# Altium schematic sheet 4-20mA.SchDoc: Isolated 4-20mA
size A4; Revision: 1; SheetNumber: 5; SheetTotal: 7; SheetSize: A4
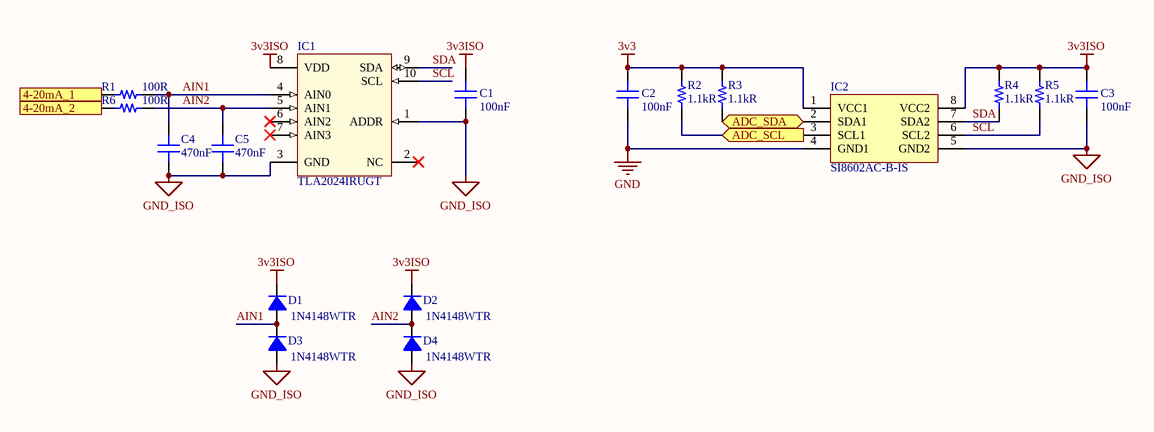
[diagram p0: 4-20mA.SchDoc]

## Parts
C1  100nF  [CAP 0603/1608]
C2  100nF  [CAP 0603/1608]
C3  100nF  [CAP 0603/1608]
C4  470nF  [CAP 0603/1608]
C5  470nF  [CAP 0603/1608]
D1  1N4148WTR  [sod123]
D2  1N4148WTR  [sod123]
D3  1N4148WTR  [sod123]
D4  1N4148WTR  [sod123]
IC1  TLA2024IRUGT  [TI X2QFN-10 2x1.5mm]
IC2  SI8602AC-B-IS  [MICROCHIP SOIC-8 208MIL WIDE]
R1  100R  [RES 0603/1608]
R2  1.1kR  [RES 0603/1608]
R3  1.1kR  [RES 0603/1608]
R4  1.1kR  [RES 0603/1608]
R5  1.1kR  [RES 0603/1608]
R6  100R  [RES 0603/1608]

## Ports
4-20mA_1 (in), 4-20mA_2 (in), ADC_SCL (in), ADC_SDA (bidir)

## Nets
3v3: C2.2 IC2.1(VCC1) R2.1 R3.1
3v3ISO: C1.2 C3.2 D1.2 D2.2 IC1.8(VDD) IC2.8(VCC2) R4.1 R5.1
GND: C2.1 IC2.4(GND1)
GND_ISO: C1.1 C3.1 C4.1 C5.1 D3.1 D4.1 IC1.1(ADDR) IC1.3(GND) IC2.5(GND2)
4-20mA_1: R1.1 ; port 4-20mA_1
4-20mA_2: R6.1 ; port 4-20mA_2
ADC_SCL: IC2.3(SCL1) R2.2 ; port ADC_SCL
ADC_SDA: IC2.2(SDA1) R3.2 ; port ADC_SDA
AIN1: C4.2 D1.1 D3.2 IC1.4(AIN0) R1.2
AIN2: C5.2 D2.1 D4.2 IC1.5(AIN1) R6.2
SCL: IC1.10(SCL) IC2.6(SCL2) R5.2
SDA: IC1.9(SDA) IC2.7(SDA2) R4.2

Not connected (* = marked no-connect by the designer): IC1 2(NC)* 6(AIN2)* 7(AIN3)*

## Notes on the sheet
- Title:
- Size:
- Project:
- Revision:
- Sheet
- of
- Date:
- YıLDıZ IoT
- Elperek Mahallesi
- Saray Sokak, No:12
- SAKARYA / TURKEY
- File:

## Library data of the parts
C1-C3 = Capacitor - Ceramic: Ceramic, SMT Capacitor; Manufacturer: Samsung; Manufacturer Part Number: CL10B104JB8NNNC; Tolerance: 5%; Voltage Rating: 50V; Dielectric: X7R; Supplier 1: Digi-Key; Supplier Part Number 1: 1276-1033-1-ND; Stock 1: 223594; Pricing 1: 1 = 0,10000, 10 = 0,05300, 100 = 0,02350, 500 = 0,01680, 1000 = 0,01320 (USD); RoHS: Yes; Mount: Surface Mount; Case/Package: 0603; Case Code (Metric): 1608; Case Code (Imperial): 0603; Material: Ceramic; Contact Plating: Tin; Min Operating Temperature: -55°C; Max Operating Temperature: 125°C; Packaging: Tape and Reel; Package Quantity: 1; Capacitance: 100nF; Voltage: 50V; Length: 1.6mm; Height: 0.8mm; Width: 0.031inch; Thickness: 0.035inch; Depth: 0.8mm; Radiation Hardening: No; ComponentLink1URL: https://media.digikey.com/pdf/Data%20Sheets/Samsung%20PDFs/CL_Series_MLCC_ds.pdf?src-supplier=Digi-Key; ComponentLink1Description: https://media.digikey.com/pdf/Data%20Sheets/Samsung%20PDFs/CL_Series_MLCC_ds.pdf?src-supplier=Digi-Key; ComponentLink2URL: https://www.verical.com/server-webapp/html/getDatasheet?partID=359321&src-supplier=Verical; ComponentLink2Description: https://www.verical.com/server-webapp/html/getDatasheet?partID=359321&src-supplier=Verical; ComponentLink3URL: http://www1.futureelectronics.com/doc/SAMSUNG/CL10B104JB8NNNC.pdf?src-supplier=Future+Electronics; ComponentLink3Description: http://www1.futureelectronics.com/doc/SAMSUNG/CL10B104JB8NNNC.pdf?src-supplier=Future+Electronics; ComponentLink4URL: https://produktinfo.conrad.com/datenblaetter/450000-474999/456613-da-01-en-VS_KONDENSATOR_0603.pdf?src-supplier=Conrad; ComponentLink4Description: https://produktinfo.conrad.com/datenblaetter/450000-474999/456613-da-01-en-VS_KONDENSATOR_0603.pdf?src-supplier=Conrad
C4 C5 = Capacitor - Ceramic: Ceramic, SMT Capacitor; Manufacturer: Taiyo Yuden; Manufacturer Part Number: UMK107ABJ474KA-T; Tolerance: 10%; Voltage Rating: 50V; Dielectric: X5R; Supplier 1: Digi-Key; Supplier Part Number 1: 587-3171-1-ND; Stock 1: 299107; Pricing 1: 1 = 0,19000, 10 = 0,13700, 100 = 0,06440, 500 = 0,04516, 1000 = 0,03739 (USD); RoHS: Yes; Mount: Surface Mount; Case/Package: 0603; Case Code (Imperial): 0603; Case Code (Metric): 1608; Min Operating Temperature: -55°C; Max Operating Temperature: 85°C; Packaging: Tape and Reel; Package Quantity: 1; Capacitance: 470nF; Voltage Rating (DC): 50V; Termination: SMD/SMT; Voltage: 50V; Length: 1.6mm; Height: 0.8mm; Width: 0.8mm; Thickness: 0.037inch; Depth: 0.8mm; Radiation Hardening: No; Lead Free: Lead Free; ComponentLink1URL: https://datasheet.ciiva.com/30226/445umk107abj474ka-t-30226784.pdf?src-supplier=Onlinecomponents.com; ComponentLink1Description: https://datasheet.ciiva.com/30226/445umk107abj474ka-t-30226784.pdf?src-supplier=Onlinecomponents.com; ComponentLink2URL: https://datasheet.ciiva.com/6282/umk107abj474ka-t-6282326.pdf?src-supplier=Digi-Key; ComponentLink2Description: https://datasheet.ciiva.com/6282/umk107abj474ka-t-6282326.pdf?src-supplier=Digi-Key; ComponentLink3URL: https://datasheet.ciiva.com/15922/30umk107abj474ka-t-15922603.pdf?src-supplier=Onlinecomponents.com; ComponentLink3Description: https://datasheet.ciiva.com/15922/30umk107abj474ka-t-15922603.pdf?src-supplier=Onlinecomponents.com; ComponentLink4URL: https://datasheet.ciiva.com/11600/umk107abj474ka-t-ss-11600413.pdf?src-supplier=Avnet; ComponentLink4Description: https://datasheet.ciiva.com/11600/umk107abj474ka-t-ss-11600413.pdf?src-supplier=Avnet; ComponentLink5URL: https://datasheet.ciiva.com/6282/umk107abj474ka-t-6282332.pdf?src-supplier=Digi-Key; ComponentLink5Description: https://datasheet.ciiva.com/6282/umk107abj474ka-t-6282332.pdf?src-supplier=Digi-Key
D1-D4 = Diode: Manufacturer: SMC; Max Reverse Voltage (DC): 75V; Average Rectified Current: 250mA; Reverse Recovery Time: 4ns; ComponentLink1URL: http://www.smc-diodes.com/propdf/1N4148W%20N0571%20REV.D.pdf?src-supplier=Digi-Key; ComponentLink1Description: http://www.smc-diodes.com/propdf/1N4148W%20N0571%20REV.D.pdf?src-supplier=Digi-Key; Supplier 1: Digi-Key; Supplier Part Number 1: 1655-1360-1-ND; Manufacturer Part Number: 1N4148WTR; Stock 1: 8882; Pricing 1: 1 = 0,12000, 10 = 0,11300, 25 = 0,10720, 100 = 0,04710, 250 = 0,04524, 500 = 0,03702, 1000 = 0,02571 (USD); RoHS: No; Mount: Surface Mount; Packaging: Tape and Reel
IC1 = TI TLA202x: Integrated Circuit; Manufacturer: Texas Instruments; Number of Bits: 12; Sampling Rate: 3300S/s; Number of A/D Converters: 1; Interface: I2C; Number of Inputs: 4; Supplier 1: Digi-Key; Supplier Part Number 1: 296-48346-1-ND; Manufacturer Part Number: TLA2024IRUGT; Stock 1: 5713; Pricing 1: 1 = 1,94000, 10 = 1,74400, 25 = 1,64520, 100 = 1,31600 (USD); RoHS: No; Min Operating Temperature: -40°C; Max Operating Temperature: 85°C; Packaging: Cut Tape; ComponentLink1URL: http://www.ti.com/lit/ds/symlink/tla2022.pdf?src-supplier=Farnell; ComponentLink1Description: http://www.ti.com/lit/ds/symlink/tla2022.pdf?src-supplier=Farnell; ComponentLink2URL: http://www.ti.com/lit/ds/symlink/tla2021.pdf?src-supplier=Digi-Key; ComponentLink2Description: http://www.ti.com/lit/ds/symlink/tla2021.pdf?src-supplier=Digi-Key; ComponentLink3URL: http://www.ti.com/general/docs/suppproductinfo.tsp?distId=10&amp;gotoUrl=http%3A%2F%2Fwww.ti.com%2Flit%2Fgpn%2Ftla2021&src-supplier=Digi-Key; ComponentLink3Description: http://www.ti.com/general/docs/suppproductinfo.tsp?distId=10&amp;gotoUrl=http%3A%2F%2Fwww.ti.com%2Flit%2Fgpn%2Ftla2021&src-supplier=Digi-Key
IC2 = SI LABS SI8602: Manufacturer: Silicon Labs; Min Supply Voltage: 3V; Max Supply Voltage: 5.5V; Number of Channels: 2; Rise Time: 4ns; Data Rate: 1.7Mbps; Propagation Delay: 55ns; Polarity: Bidirectional,Unidirectional; Operating Supply Current: 4.7mA; Max Power Dissipation: 220mW; Channel Type: Bidirectional; Max Input Current: 7.1mA; Isolated Power: No; Supplier 1: Digi-Key; Supplier Part Number 1: 336-2050-5-ND; Manufacturer Part Number: SI8602AC-B-IS; Stock 1: 2420; Pricing 1: 1 = 2,99000, 25 = 2,87920, 100 = 2,76850, 1000 = 2,51989 (USD); RoHS: Yes; Case/Package: SOIC; Number of Pins: 8; Weight: 0.001764oz; Min Operating Temperature: -40°C; Max Operating Temperature: 125°C; Packaging: Rail/Tube; Length: 5mm; Width: 4mm; Depth: 1.55mm; REACH SVHC: Unknown; ComponentLink1URL: http://www.mouser.com/ds/2/368/Si860x-51606.pdf; ComponentLink1Description: http://www.mouser.com/ds/2/368/Si860x-51606.pdf; ComponentLink2URL: https://www.silabs.com/documents/public/data-sheets/Si860x.pdf; ComponentLink2Description: https://www.silabs.com/documents/public/data-sheets/Si860x.pdf
R1 R6 = Resistor_Chip: Ceramic, SMT Capacitor; Manufacturer: Yageo; Manufacturer Part Number: RC0603FR-07100RL; Voltage Rating (DC): 50V; Tolerance: 1%; Temperature Coefficient: 100ppm/°C; Power Rating: 100mW; Supplier 1: Digi-Key; Supplier Part Number 1: 311-100HRDKR-ND; Stock 1: 12121627; Pricing 1: 1 = 0,10000, 10 = 0,02300, 100 = 0,00940, 1000 = 0,00421, 2500 = 0,00366 (USD); RoHS: Yes; Case/Package: 0603; Number of Pins: 2; Case Code (Imperial): 0603; Case Code (Metric): 1608; Min Operating Temperature: -55°C; Max Operating Temperature: 155°C; Resistance: 100R; Packaging: Tape and Reel; Composition: Thick Film; Voltage Rating: 50V; Termination: SMD/SMT; Military Standard: Not; Length: 1.6mm; Height: 0.45mm; Width: 0.8mm; Depth: 0.8mm; REACH SVHC: Unknown; Lead Free: Lead Free; ComponentLink1URL: https://datasheet.ciiva.com/7660/38590-7660788.pdf?src-supplier=Element14; ComponentLink1Description: https://datasheet.ciiva.com/7660/38590-7660788.pdf?src-supplier=Element14; ComponentLink2URL: https://datasheet.ciiva.com/11808/0900766b80f96399-11808280.pdf?src-supplier=RSComponents; ComponentLink2Description: https://datasheet.ciiva.com/11808/0900766b80f96399-11808280.pdf?src-supplier=RSComponents; ComponentLink3URL: https://datasheet.ciiva.com/7746/1738695-7746237.pdf?src-supplier=Element14; ComponentLink3Description: https://datasheet.ciiva.com/7746/1738695-7746237.pdf?src-supplier=Element14; ComponentLink4URL: https://datasheet.ciiva.com/7746/1738695-7746238.pdf?src-supplier=Element14; ComponentLink4Description: https://datasheet.ciiva.com/7746/1738695-7746238.pdf?src-supplier=Element14; ComponentLink5URL: https://datasheet.ciiva.com/22747/443971-22747518.pdf?src-supplier=Element14; ComponentLink5Description: https://datasheet.ciiva.com/22747/443971-22747518.pdf?src-supplier=Element14; ComponentLink6URL: https://datasheet.ciiva.com/46440/1868787-46440890.pdf?src-supplier=Element14; ComponentLink6Description: https://datasheet.ciiva.com/46440/1868787-46440890.pdf?src-supplier=Element14
R2-R5 = Resistor_Chip: Ceramic, SMT Capacitor; Manufacturer: Stackpole Electronics; Manufacturer Part Number: RMCF0603FT1K10; Power Rating: 100mW; Tolerance: 1%; Temperature Coefficient: 100ppm/°C; Supplier 1: Digi-Key; Supplier Part Number 1: RMCF0603FT1K10CT-ND; Stock 1: 27246; Pricing 1: 1 = 0,10000, 10 = 0,01800, 100 = 0,00710, 1000 = 0,00321, 2500 = 0,00278 (USD); RoHS: Yes; Mount: Surface Mount; Case/Package: 0603; Case Code (Metric): 1608; Case Code (Imperial): 0603; Contact Plating: Matte,Tin; Min Operating Temperature: -55°C; Max Operating Temperature: 155°C; Resistance: 1.1kR; Packaging: Tape and Reel; Composition: Thick Film; Number of Terminations: 2; Max Power Dissipation: 100mW; Features: Automotive AEC-Q200; Length: 0.061inch; Height: 0.022inch; Width: 0.031inch; Radiation Hardening: No; Lead Free: Lead Free